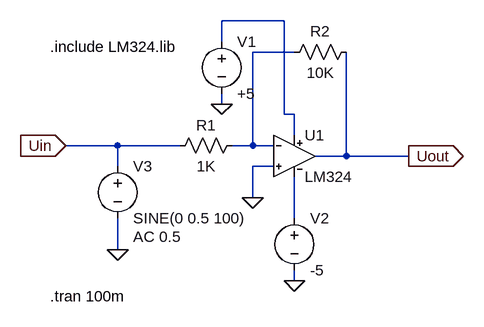
[diagram p0: schematic 2_1_b.asc]
2_1_b.asc, the LTspice schematic file:
Version 4.1
SHEET 1 880 680
WIRE 304 -64 208 -64
WIRE 208 -32 208 -64
WIRE 320 -16 256 -16
WIRE 208 64 208 48
WIRE 304 80 304 -64
WIRE 320 80 304 80
WIRE 320 112 320 80
WIRE 48 128 -32 128
WIRE 144 128 48 128
WIRE 256 128 256 -16
WIRE 256 128 224 128
WIRE 288 128 256 128
WIRE 400 144 400 -16
WIRE 400 144 352 144
WIRE 496 144 400 144
WIRE 48 160 48 128
WIRE 288 160 256 160
WIRE 256 208 256 160
WIRE 320 240 320 176
WIRE 48 288 48 240
WIRE 320 336 320 320
FLAG 256 208 0
FLAG 208 64 0
FLAG 320 336 0
FLAG -32 128 Uin
IOPIN -32 128 In
FLAG 496 144 Uout
IOPIN 496 144 Out
FLAG 48 288 0
SYMBOL LM324 320 144 R0
SYMATTR InstName U1
SYMBOL res 240 112 R90
WINDOW 0 0 56 VBottom 2
WINDOW 3 32 56 VTop 2
SYMATTR InstName R1
SYMATTR Value 1K
SYMATTR SpiceLine tol=1 pwr=0.1
SYMBOL res 416 -32 R90
WINDOW 0 0 56 VBottom 2
WINDOW 3 32 56 VTop 2
SYMATTR InstName R2
SYMATTR Value 10K
SYMATTR SpiceLine tol=1 pwr=0.1
SYMBOL voltage 208 -48 R0
WINDOW 123 0 0 Left 0
WINDOW 39 0 0 Left 0
SYMATTR InstName V1
SYMATTR Value +5
SYMBOL voltage 320 224 R0
WINDOW 123 0 0 Left 0
WINDOW 39 0 0 Left 0
SYMATTR InstName V2
SYMATTR Value -5
SYMBOL voltage 48 144 R0
WINDOW 123 24 124 Left 2
WINDOW 39 0 0 Left 0
SYMATTR InstName V3
SYMATTR Value SINE(0 0.5 100)
SYMATTR Value2 AC 0.5
TEXT -56 -24 Left 2 !.include LM324.lib
TEXT -56 360 Left 2 !.tran 100m

The netlist it stands for:
* 2_1_b.asc
X§U1 0 N002 N001 N003 Uout LM324  ; pins In+ In- V+ V- OUT
R1 N002 Uin 1K tol=1 pwr=0.1
R2 Uout N002 10K tol=1 pwr=0.1
V1 N001 0 +5
V2 N003 0 -5
V3 Uin 0 SINE(0 0.5 100) AC 0.5
.include LM324.lib
.tran 100m
.backanno
.end